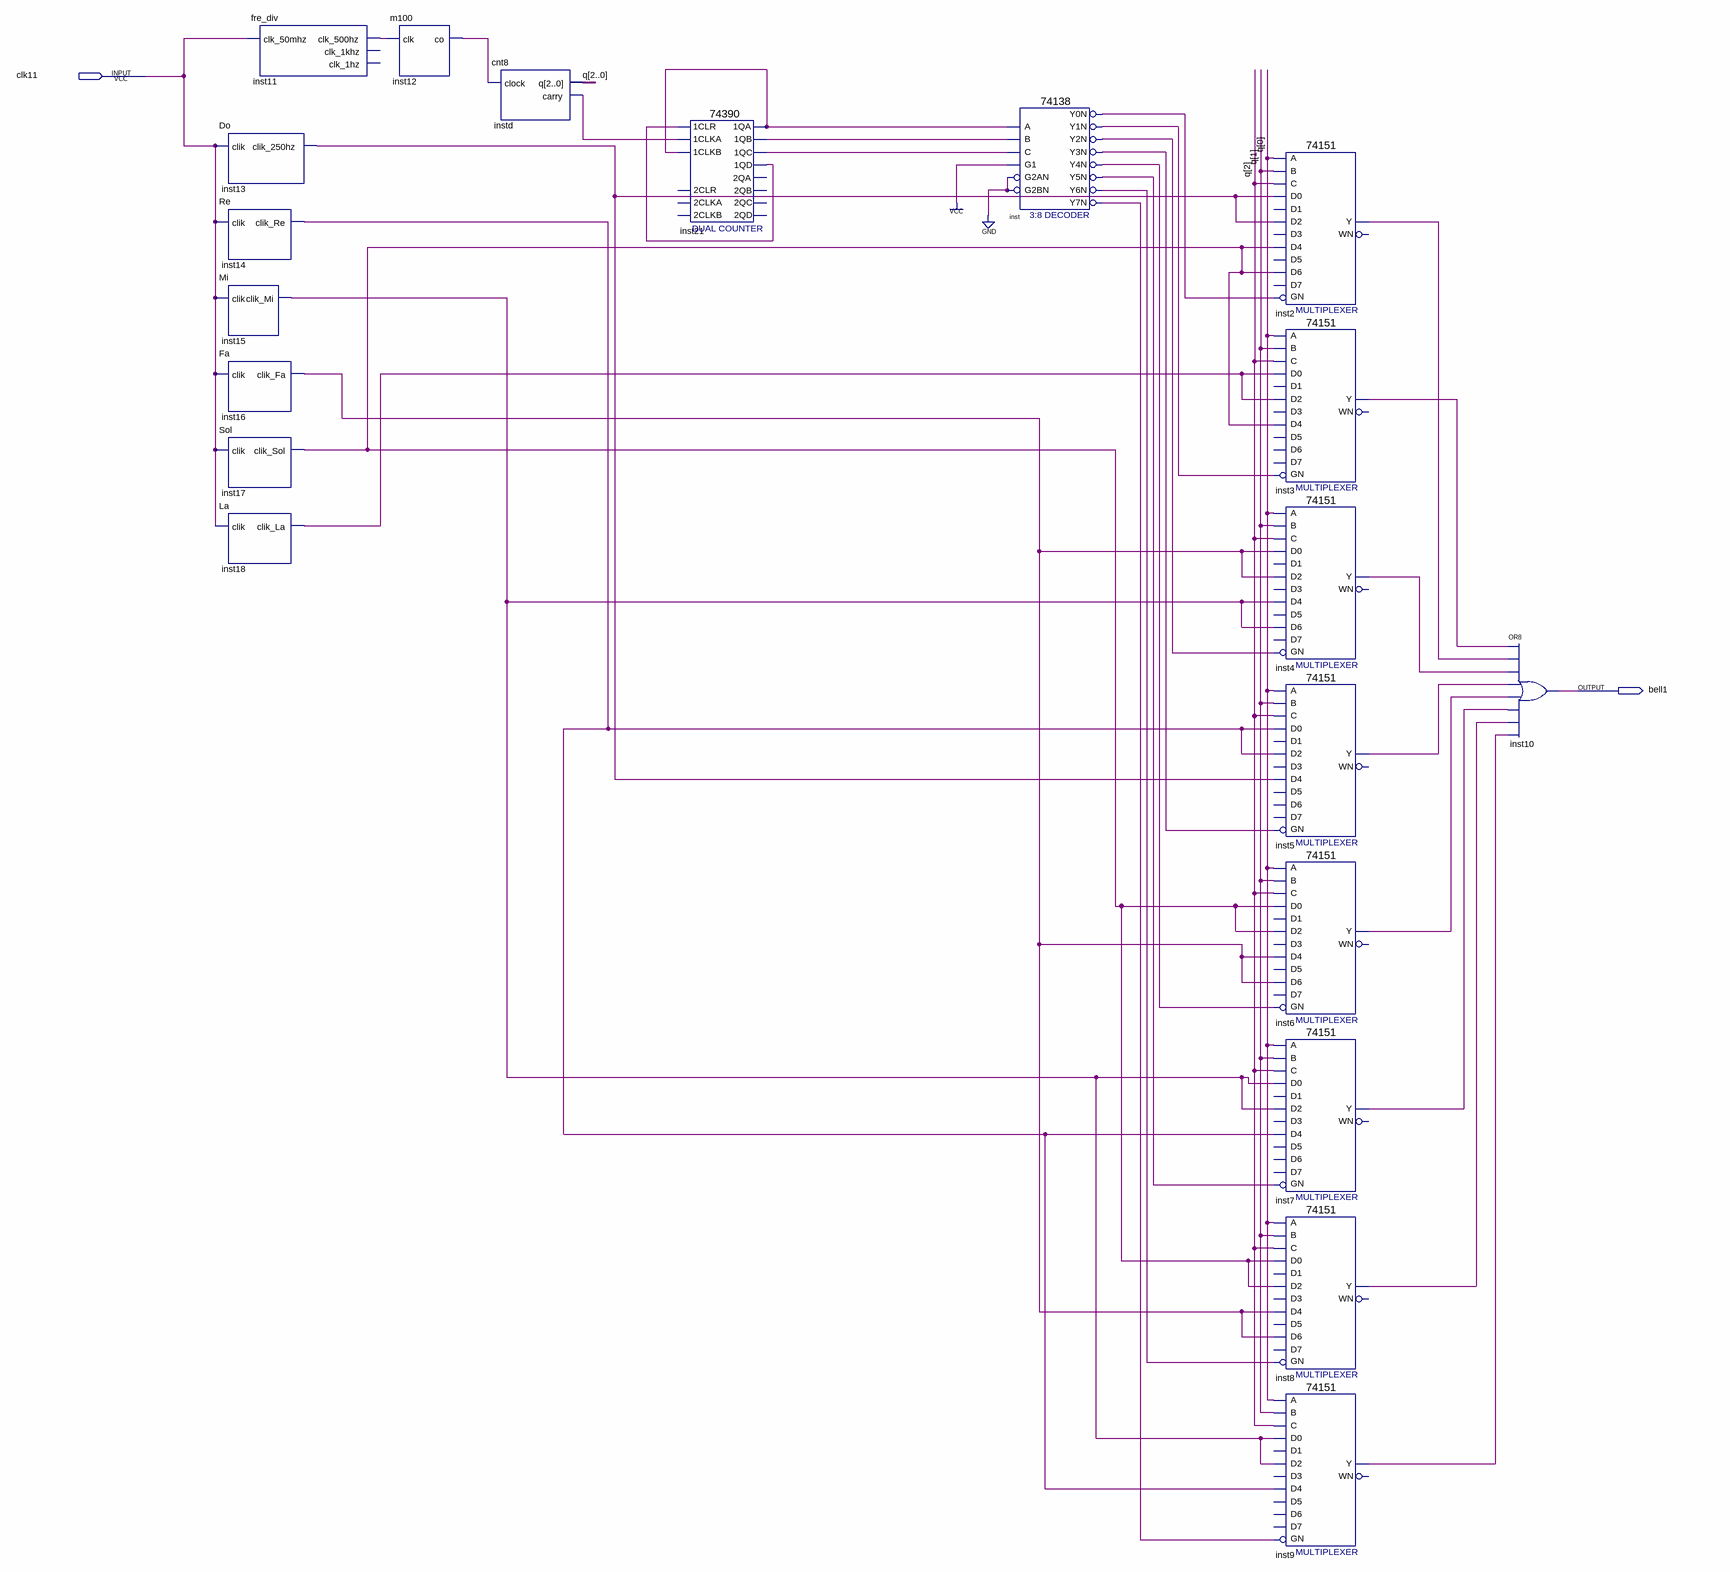
[diagram p0: schematic sheet]
// Quartus schematic music1.bdf as structural Verilog: 20 symbols, 2 pins
module music1 (
  input  clk11,
  output bell1
);

  wire inst2_y, inst3_y, inst4_y, inst5_y, inst6_y, inst7_y, inst8_y, inst9_y, inst11_clk_500hz, inst12_co,
       inst13_clik_250hz, inst14_clik_re, inst15_clik_mi, inst16_clik_fa, inst17_clik_sol, inst18_clik_la,
       inst21_1qa, inst21_1qb, inst21_1qc, inst21_1qd, inst_y0n, inst_y1n, inst_y2n, inst_y3n, inst_y4n,
       inst_y5n, inst_y6n, inst_y7n, instd_carry;
  wire [2:0] q;

  fre_div inst11 (.clk_50mhz(clk11), .clk_500hz(inst11_clk_500hz));  // open: clk_1khz, clk_1hz
  Do inst13 (.clik(clk11), .clik_250hz(inst13_clik_250hz));
  Re inst14 (.clik(clk11), .clik_Re(inst14_clik_re));
  Mi inst15 (.clik(clk11), .clik_Mi(inst15_clik_mi));
  Fa inst16 (.clik(clk11), .clik_Fa(inst16_clik_fa));
  Sol inst17 (.clik(clk11), .clik_Sol(inst17_clik_sol));
  La inst18 (.clik(clk11), .clik_La(inst18_clik_la));
  m100 inst12 (.clk(inst11_clk_500hz), .co(inst12_co));
  cnt8 instd (.clock(inst12_co), .q(q), .carry(instd_carry));
  \74390  inst21 (
    .\1CLR (inst21_1qd), .\1CLKA (instd_carry), .\1CLKB (inst21_1qa), .\1QA (inst21_1qa), .\1QB (inst21_1qb),
    .\1QC (inst21_1qc), .\1QD (inst21_1qd));  // open: 2CLKA, 2CLR, 2CLKB, 2QA, 2QB, 2QC, 2QD
  \74138  inst (
    .A(inst21_1qa), .B(inst21_1qb), .G1(1'b1), .C(inst21_1qc), .G2AN(1'b0), .G2BN(1'b0), .Y0N(inst_y0n),
    .Y1N(inst_y1n), .Y2N(inst_y2n), .Y3N(inst_y3n), .Y4N(inst_y4n), .Y5N(inst_y5n), .Y6N(inst_y6n),
    .Y7N(inst_y7n));
  \74151  inst2 (
    .GN(inst_y0n), .C(q[2]), .B(q[1]), .A(q[0]), .D0(inst13_clik_250hz), .D4(inst17_clik_sol),
    .D2(inst13_clik_250hz), .D6(inst17_clik_sol), .Y(inst2_y));  // open: D5, D1, D3, D7, WN
  \74151  inst3 (
    .GN(inst_y1n), .C(q[2]), .B(q[1]), .A(q[0]), .D0(inst18_clik_la), .D4(inst17_clik_sol),
    .D2(inst18_clik_la), .Y(inst3_y));  // open: D5, D1, D3, D6, D7, WN
  \74151  inst4 (
    .GN(inst_y2n), .C(q[2]), .B(q[1]), .A(q[0]), .D0(inst16_clik_fa), .D4(inst15_clik_mi),
    .D2(inst16_clik_fa), .D6(inst15_clik_mi), .Y(inst4_y));  // open: D5, D1, D3, D7, WN
  \74151  inst5 (
    .GN(inst_y3n), .C(q[2]), .B(q[1]), .A(q[0]), .D0(inst14_clik_re), .D4(inst13_clik_250hz),
    .D2(inst14_clik_re), .Y(inst5_y));  // open: D5, D1, D3, D6, D7, WN
  \74151  inst6 (
    .GN(inst_y4n), .C(q[2]), .B(q[1]), .A(q[0]), .D0(inst17_clik_sol), .D4(inst16_clik_fa),
    .D2(inst17_clik_sol), .D6(inst16_clik_fa), .Y(inst6_y));  // open: D5, D1, D3, D7, WN
  \74151  inst7 (
    .GN(inst_y5n), .C(q[2]), .B(q[1]), .A(q[0]), .D0(inst15_clik_mi), .D4(inst14_clik_re),
    .D2(inst15_clik_mi), .Y(inst7_y));  // open: D5, D1, D3, D6, D7, WN
  \74151  inst8 (
    .GN(inst_y6n), .C(q[2]), .B(q[1]), .A(q[0]), .D0(inst17_clik_sol), .D4(inst16_clik_fa),
    .D2(inst17_clik_sol), .D6(inst16_clik_fa), .Y(inst8_y));  // open: D5, D1, D3, D7, WN
  \74151  inst9 (
    .GN(inst_y7n), .C(q[2]), .B(q[1]), .A(q[0]), .D0(inst15_clik_mi), .D4(inst14_clik_re),
    .D2(inst15_clik_mi), .Y(inst9_y));  // open: D5, D1, D3, D6, D7, WN
  or inst10 (bell1, inst3_y, inst2_y, inst4_y, inst5_y, inst6_y, inst7_y, inst8_y, inst9_y);
endmodule
